# EAGLE design pulsometro (EAGLE 7.2.0)
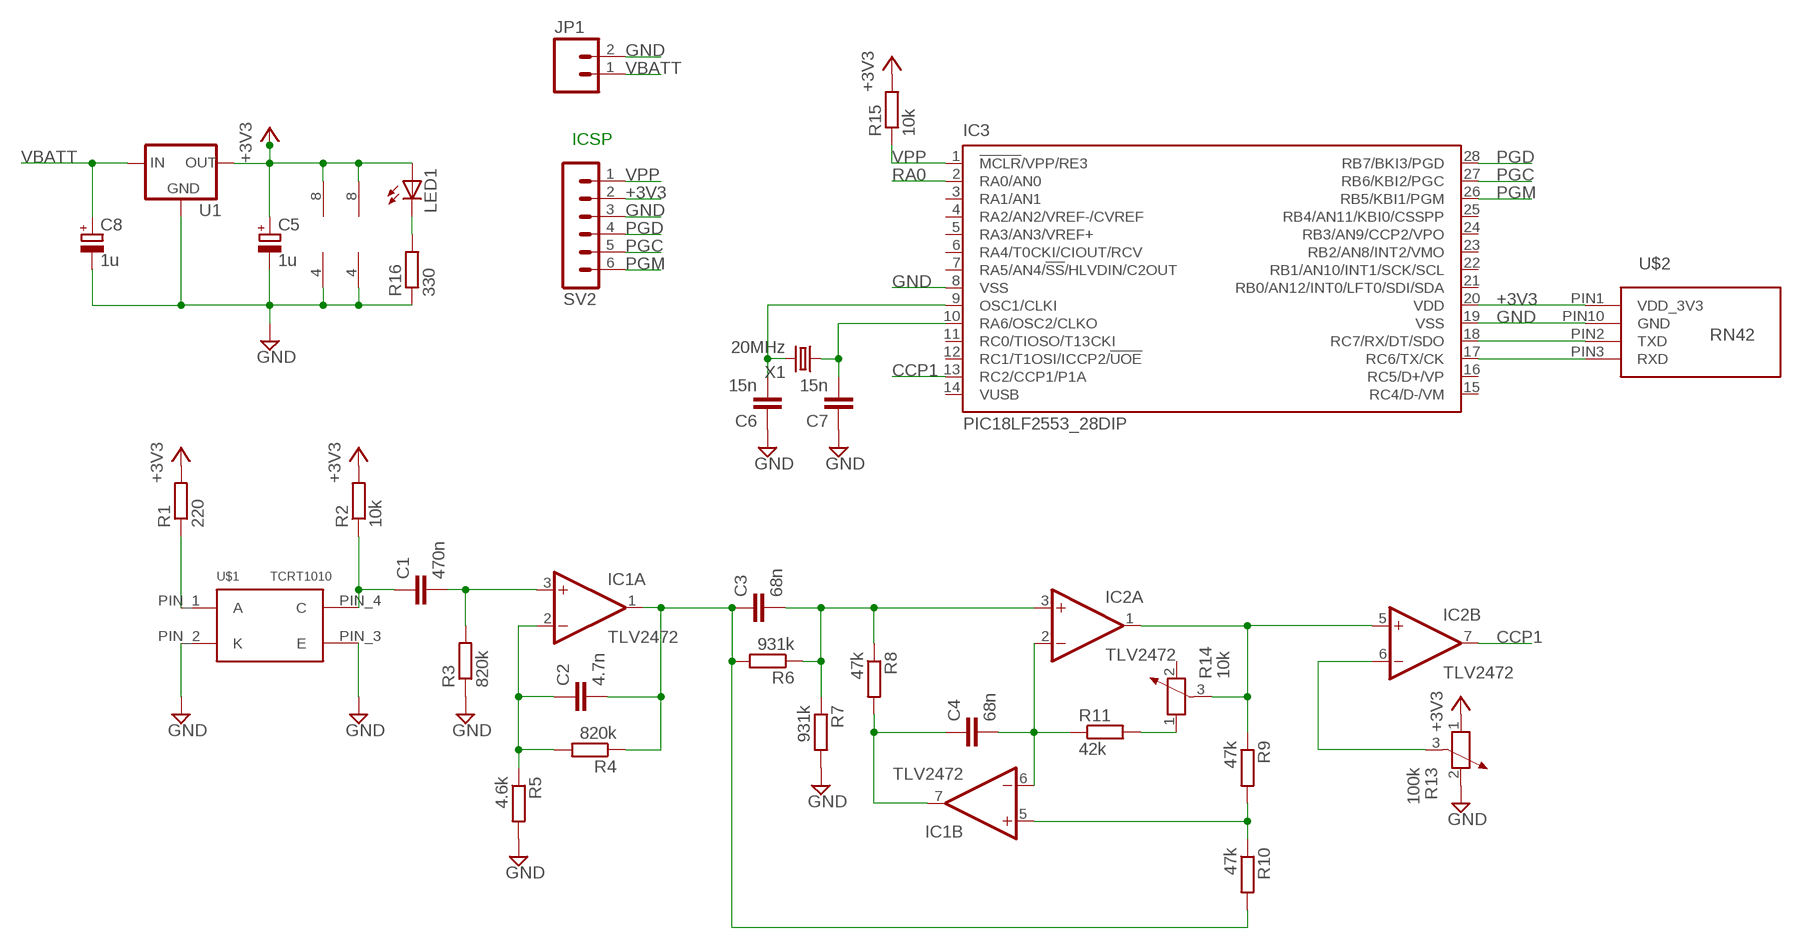
[diagram p0: schematic, sheet 1]

## Parts
C1  470n  C-EU025-025X050  [C025-025X050]
C2  4.7n  C-EU025-025X050  [C025-025X050]
C3  68n  C-EU025-025X050  [C025-025X050]
C4  68n  C-EU025-025X050  [C025-025X050]
C5  1u  CPOL-EUE2.5-5  [E2,5-5]
C6  15n  C-EU025-025X050  [C025-025X050]
C7  15n  C-EU025-025X050  [C025-025X050]
C8  1u  CPOL-EUE2.5-5  [E2,5-5]
IC1  TLV2472  LM358N  [DIL08]
IC2  TLV2472  LM358N  [DIL08]
IC3  PIC18LF2553_28DIP  PIC18F2550_28DIP  [DIL28-3]
JP1  M02PTH  [1X02]
LED1  LED3MM  [LED3MM]
R1  220  R-EU_0204/7  [0204/7]
R2  10k  R-EU_0204/7  [0204/7]
R3  820k  R-EU_0204/7  [0204/7]
R4  820k  R-EU_0204/7  [0204/7]
R5  4.6k  R-EU_0204/7  [0204/7]
R6  931k  R-EU_0204/7  [0204/7]
R7  931k  R-EU_0204/7  [0204/7]
R8  47k  R-EU_0204/7  [0204/7]
R9  47k  R-EU_0204/7  [0204/7]
R10  47k  R-EU_0204/7  [0204/7]
R11  42k  R-EU_0204/7  [0204/7]
R13  100k  POTENTIOMETER_PT-10  [PT-10]
R14  10k  POTENTIOMETER_PT-10  [PT-10]
R15  10k  R-EU_0204/7  [0204/7]
R16  330  R-EU_0204/7  [0204/7]
SV2  MA06-1  [MA06-1]
U1  V_REG_78XXTO-92_UNTESTED  [TO-92]
U$1  TCRT1010  [TCRT1010]
U$2  RN42  [2X10-2MMSOCKET]
X1  20MHz  CRYSTALS-NOGND-HC49  [HC49]

## Nets
+3V3: C5.+ IC1.8(P:V+) IC2.8(P:V+) IC3.20(VDD) LED1.A R1.2 R2.2 R13.1 R15.2 SV2.2 U1.3(OUT) U$2.PIN1(VDD_3V3)
CCP1: IC2.7(B:OUT) IC3.13(RC2/CCP1/P1A)
GND: C5.- C6.1 C7.1 C8.- IC1.4(P:V-) IC2.4(P:V-) IC3.8(VSS) IC3.19(VSS) JP1.2 R3.1 R5.2 R7.2 R13.2 R16.1 SV2.3 U1.1(GND) U$1.PIN_2(K) U$1.PIN_3(E) U$2.PIN10(GND)
N$1: R1.1 U$1.PIN_1(A)
N$3: C1.1 R2.1 U$1.PIN_4(C)
N$4: C2.1 IC1.2(A:-IN) R4.2 R5.1
N$5: C1.2 IC1.3(A:+IN) R3.2
N$6: C2.2 C3.1 IC1.1(A:OUT) R4.1 R6.2 R10.2
N$8: C3.2 IC2.3(A:+IN) R6.1 R7.1 R8.1
N$9: C4.1 IC1.7(B:OUT) R8.2
N$10: C4.2 IC1.6(B:-IN) IC2.2(A:-IN) R11.1
N$11: R11.2 R14.1
N$12: IC2.1(A:OUT) IC2.5(B:+IN) R9.1 R14.3
N$13: IC1.5(B:+IN) R9.2 R10.1
N$14: IC2.6(B:-IN) R13.3
N$15: IC3.18(RC7/RX/DT/SDO) U$2.PIN2(TXD)
N$16: IC3.17(RC6/TX/CK) U$2.PIN3(RXD)
N$17: LED1.K(C) R16.2
N$18: C7.2 IC3.10(RA6/OSC2/CLKO) X1.1
N$19: C6.2 IC3.9(OSC1/CLKI) X1.2
PGC: IC3.27(RB6/KBI2/PGC) SV2.5
PGD: IC3.28(RB7/BKI3/PGD) SV2.4
PGM: IC3.26(RB5/KBI1/PGM) SV2.6
RA0: IC3.2(RA0/AN0)
VBATT: C8.+ JP1.1 U1.2(IN)
VPP: IC3.1(!MCLR!/VPP/RE3) R15.1 SV2.1
Unconnected: IC3.3(RA1/AN1) IC3.4(RA2/AN2/VREF-/CVREF) IC3.5(RA3/AN3/VREF+) IC3.6(RA4/T0CKI/CIOUT/RCV) IC3.7(RA5/AN4/!SS!/HLVDIN/C2OUT) IC3.11(RC0/TIOSO/T13CKI) IC3.12(RC1/T1OSI/ICCP2/!UOE) IC3.14(VUSB) IC3.15(RC4/D-/VM) IC3.16(RC5/D+/VP) IC3.21(RB0/AN12/INT0/LFT0/SDI/SDA) IC3.22(RB1/AN10/INT1/SCK/SCL) IC3.23(RB2/AN8/INT2/VMO) IC3.24(RB3/AN9/CCP2/VPO) IC3.25(RB4/AN11/KBI0/CSSPP) R14.2

## Notes on the sheet
- ICSP

## Library data of the parts
C1-C4 C6 C7 = rcl:C-EU: CAPACITOR, European symbol
C5 C8 = rcl:CPOL-EU: POLARIZED CAPACITOR, European symbol
IC1 IC2 = linear:LM358: OP AMP also LM158; LM258; LM2904 Source: http://cache.national.com/ds/LM/LM158.pdf
IC3 = microchip:PIC18F2*_28: USB Microcontrollers with nanoWatt Technology High-Performance, Enhanced Flash, 28/40/44-Pin, Source: http://ww1.microchip.com/downloads/en/devicedoc/39632c.pdf; MF: MICROCHIP; MPN: PIC18F2550-I/SP; OC_FARNELL: 1523822; OC_NEWARK: 80K6054
JP1 = SparkFun-Connectors:M02: Standard 2-pin 0.1" header. Use with - straight break away headers ( PRT-00116) - right angle break away headers (PRT-00553) - swiss pins (PRT-00743) - machine pins (PRT-00117) - female headers (PRT-00115) Molex polarized connector foot print use with: PRT-08233 with associated crimp pins and housings. 2.54_SCREWTERM for use with PRT-10571. 3.5mm Screw Terminal footprints for PRT-08084 5mm Screw Terminal footprints for use with PRT-08432
LED1 = led:LED: LED OSRAM: - CHIPLED LG R971, LG N971, LY N971, LG Q971, LY Q971, LO R971, LY R971 LH N974, LH R974 LS Q976, LO Q976, LY Q976 LO Q996 - Hyper CHIPLED LW Q18S LB Q993, LB Q99A, LB R99A - SideLED LS A670, LO A670, LY A670, LG A670, LP A670 LB A673, LV A673, LT A673, LW A673 LH A674 LY A675 LS A676, LA A676, LO A676, LY A676, LW A676 LS A679, LY A679, LG A679 - Hyper Micro SIDELED® LS Y876, LA Y876, LO Y876, LY Y876 LT Y87S - SmartLED LW L88C, LW L88S LB L89C, LB L89S, LG L890 LS L89K, LO L89K, LY L89K LS L896, LA L896, LO L896, LY L896 - TOPLED LS T670, LO T670, LY T670, LG T670, LP T670 LSG T670, LSP T670, LSY T670, LOP T670, LYG T670 LG T671, LOG T671, LSG T671 LB T673, LV T673, LT T673, LW T673 LH T674 LS T676, LA T676, LO T676, LY T676, LB T676, LH T676, LSB T676, LW T676 LB T67C, LV T67C, LT T67C, LS T67K, LO T67K, LY T67K, LW E67C LS E67B, LA E67B, LO E67B, LY E67B, LB E67C, LV E67C, LT E67C LW T67C LS T679, LY T679, LG T679 LS T770, LO T770, LY T770, LG T770, LP T770 LB T773, LV T773, LT T773, LW T773 LH T774 LS E675, LA E675, LY E675, LS T675 LS T776, LA T776, LO T776, LY T776, LB T776 LHGB T686 LT T68C, LB T68C - Hyper Mini TOPLED® LB M676 - Mini TOPLED Santana® LG M470 LS M47K, LO M47K, LY M47K Source: http://www.osram.convergy.de LUXEON: - LUMILED® LXK2-PW12-R00, LXK2-PW12-S00, LXK2-PW14-U00, LXK2-PW14-V00 LXK2-PM12-R00, LXK2-PM12-S00, LXK2-PM14-U00 LXK2-PE12-Q00, LXK2-PE12-R00, LXK2-PE12-S00, LXK2-PE14-T00, LXK2-PE14-U00 LXK2-PB12-K00, LXK2-PB12-L00, LXK2-PB12-M00, LXK2-PB14-N00, LXK2-PB14-P00, LXK2-PB14-Q00 LXK2-PR12-L00, LXK2-PR12-M00, LXK2-PR14-Q00, LXK2-PR14-R00 LXK2-PD12-Q00, LXK2-PD12-R00, LXK2-PD12-S00 LXK2-PH12-R00, LXK2-PH12-S00 LXK2-PL12-P00, LXK2-PL12-Q00, LXK2-PL12-R00 Source: www.luxeon.com KINGBRIGHT: KA-3528ASYC Source: www.kingbright.com
R1-R11 R15 R16 = rcl:R-EU_: RESISTOR, European symbol
R13 R14 = rcl:POTENTIOMETER_: Potentiometer
SV2 = con-lstb:MA06-1: PIN HEADER; OC_FARNELL: unknown; OC_NEWARK: unknown
U1 = SparkFun-PowerIC:V_REG_78XX: Voltage Regulator Standard 78xx regulator. IGO (Input Ground Output). Spark Fun Electronics SKU : COM-00107
U$1 = pulsometro:TCRT1010
U$2 = pulsometro:RN42
X1 = IQD-Frequency-Products:CRYSTALS-NOGND: CRYSTALS CAN NOT GROUNDED

## Board
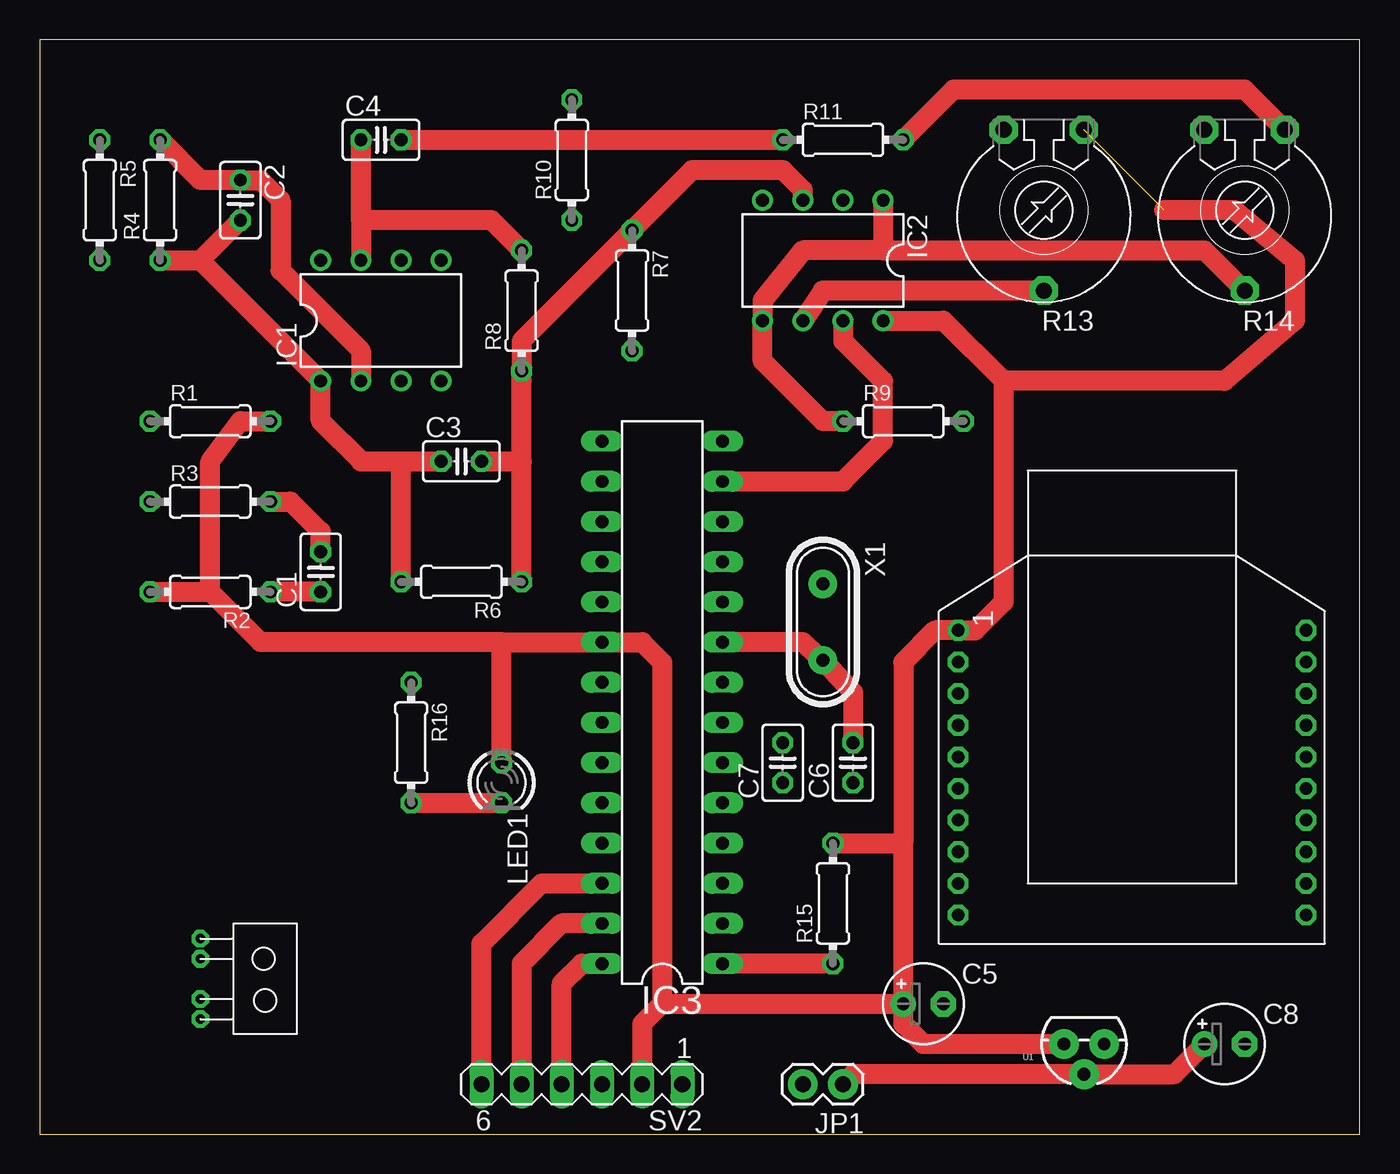
[diagram p1: board, top side]
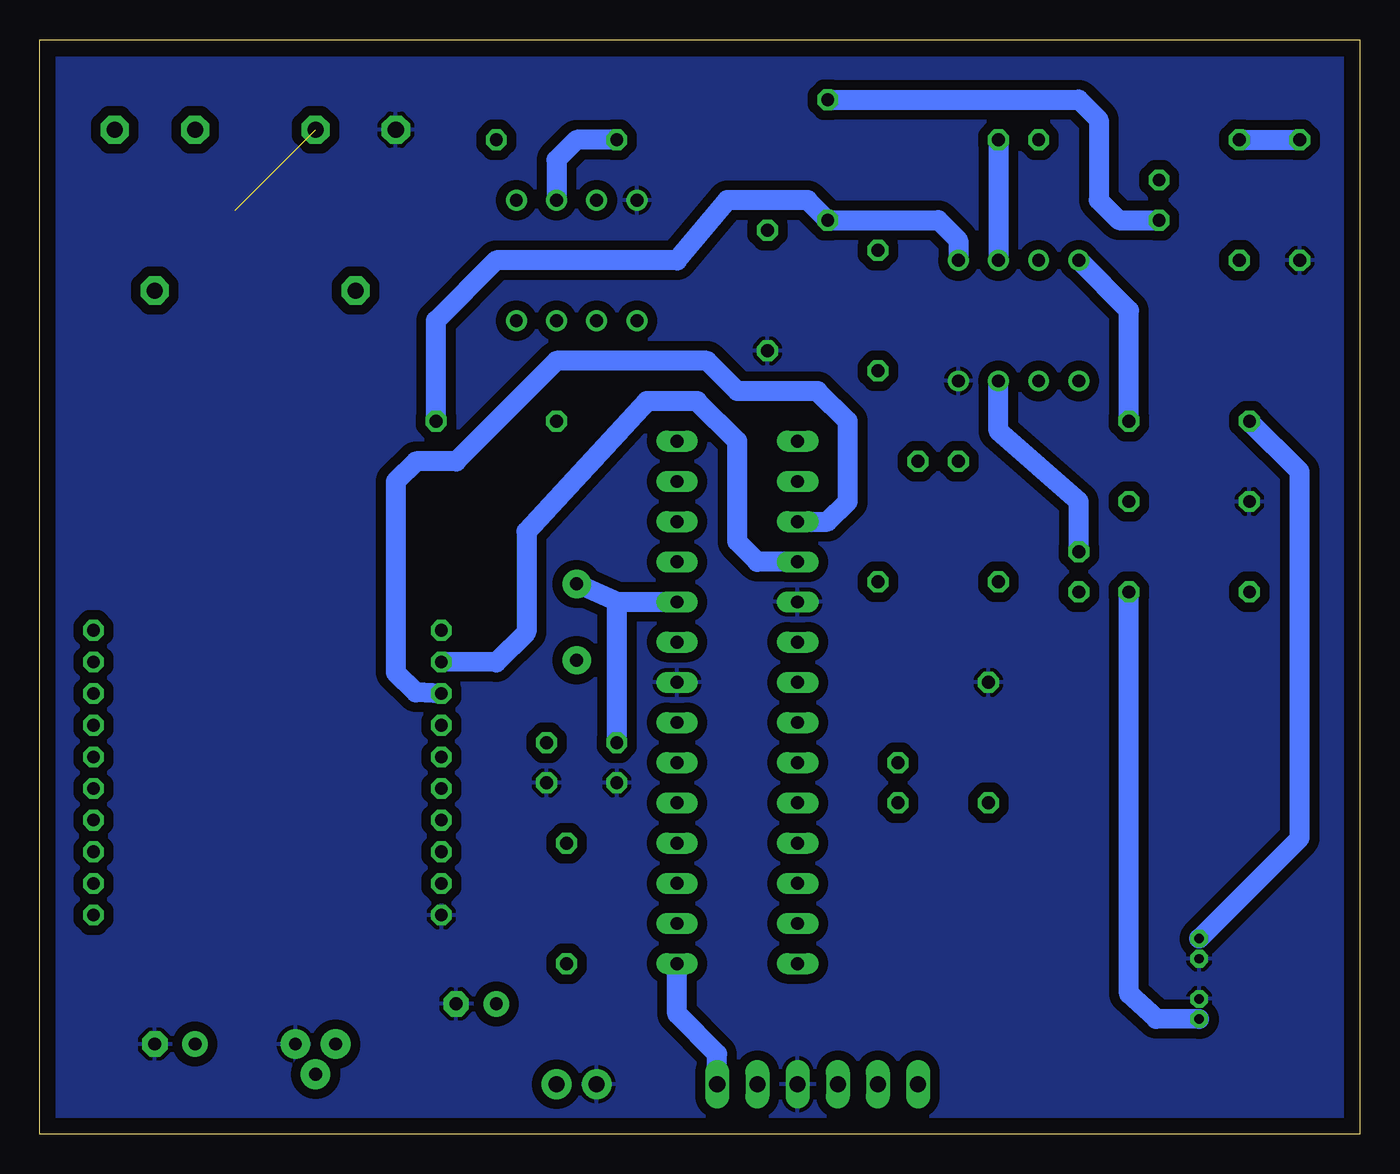
[diagram p2: board, bottom side, seen from below]

Size 83.49 x 69.21 mm. Coordinates in mm from the lower left corner, seen from the top.
Outline: 0,0 83.49,0 83.49,69.21 0,69.21 0,0
Copper layers (1*16): Top 0.035mm / dielectric 1.5mm / Bottom 0.035mm
Design rules "default *": minimum track width 50mil, minimum drill 24mil, track to track 24mil, track to pad 24mil, pad to pad 24mil, via to via 24mil, smd to smd 24mil, copper to edge 40mil, drill to drill 16mil, minimum pad ring 10mil, minimum via ring 8mil, stop-mask expansion 4mil, vias tented up to drill 0mil, thermal gap 10mil

### Footprints (pad centres in the part's own frame; a part is rotated, then mirrored left to right if it is on the bottom)
C025-025X050 = drill 0.813 octagon: 1 -1.27,0; 2 1.27,0
E2,5-5 = drill 0.813 pad 1.6: + -1.27,0 | drill 0.813 pad 1.6 octagon: - 1.27,0
DIL08 = drill 0.813 pad 1.27: 1 -3.81,-3.81; 2 -1.27,-3.81; 3 1.27,-3.81; 4 3.81,-3.81; 5 3.81,3.81; 6 1.27,3.81; 7 -1.27,3.81; 8 -3.81,3.81
DIL28-3 = drill 0.813 long: 1 -16.51,-3.81; 2 -13.97,-3.81; 3 -11.43,-3.81; 4 -8.89,-3.81; 5 -6.35,-3.81; 6 -3.81,-3.81; 7 -1.27,-3.81; 8 1.27,-3.81; 9 3.81,-3.81; 10 6.35,-3.81; 11 8.89,-3.81; 12 11.43,-3.81; 13 13.97,-3.81; 14 16.51,-3.81; 15 16.51,3.81; 16 13.97,3.81; 17 11.43,3.81; 18 8.89,3.81; 19 6.35,3.81; 20 3.81,3.81; 21 1.27,3.81; 22 -1.27,3.81; 23 -3.81,3.81; 24 -6.35,3.81; 25 -8.89,3.81; 26 -11.43,3.81; 27 -13.97,3.81; 28 -16.51,3.81
1X02 = drill 1.016 pad 1.88: 1 0,0; 2 2.54,0
LED3MM = drill 0.813 octagon: A -1.27,0; K 1.27,0
0204/7 = drill 0.813 octagon: 1 -3.81,0; 2 3.81,0
PT-10 = drill 1.016 pad 1.778 octagon: 1 -2.54,-5.08; 2 2.54,-5.08; 3 0,5.08
MA06-1 = drill 1.016 long: 1 -6.35,0; 2 -3.81,0; 3 -1.27,0; 4 1.27,0; 5 3.81,0; 6 6.35,0
TO-92 = drill 0.813 pad 1.88: 1 -1.27,0; 2 0,1.905; 3 1.27,0
TCRT1010 = drill 0.6 pad 0.813 octagon: PIN_1 0.96,0; PIN_2 2.23,0; PIN_3 4.77,0; PIN_4 6.04,0
2X10-2MMSOCKET = drill 0.8 octagon: P$1 1.8,1.2; P$2 3.8,1.2; P$3 5.8,1.2; P$4 7.8,1.2; P$5 9.8,1.2; P$6 11.8,1.2; P$7 13.8,1.2; P$8 15.8,1.2; P$9 17.8,1.2; P$10 19.8,1.2; P$12 3.8,23.2; P$13 5.8,23.2; P$14 7.8,23.2; P$15 9.8,23.2; P$16 11.8,23.2; P$17 13.8,23.2; PIN1 19.8,23.2; PIN2 17.8,23.2; PIN3 15.8,23.2; PIN10 1.8,23.2
HC49 = drill 0.813 pad 1.8: 1 -2.413,0; 2 2.413,0

### Placement (x,y rotation side)
C1  17.78,35.56 90 top
C2  12.7,59.05 270 top
C3  26.67,42.55 0 top
C4  21.59,62.87 0 top
C5  55.88,8.25 0 top
C6  51.43,23.49 90 top
C7  46.99,23.49 90 top
C8  74.93,5.71 0 top
IC1  21.59,51.43 0 top
IC2  49.53,55.24 180 top
IC3  39.37,27.3 90 top
JP1  50.8,3.18 180 top
LED1  29.21,22.23 270 top
R1  10.79,45.09 0 top
R2  10.79,34.29 180 top
R3  10.79,40.01 0 top
R4  7.62,59.05 90 top
R5  3.81,59.05 270 top
R6  26.67,34.92 180 top
R7  37.46,53.34 270 top
R8  30.48,52.07 90 top
R9  54.61,45.09 0 top
R10  33.66,61.6 90 top
R11  50.8,62.87 0 top
R13  63.5,58.42 180 top
R14  76.2,58.42 180 top
R15  50.16,14.61 90 top
R16  23.49,24.77 270 top
SV2  34.29,3.18 180 top
U1  66.04,5.71 180 top
U$1  10.16,13.34 270 top
U$2  81.28,12.06 90 top
X1  49.53,32.38 270 top

### Tracks (layer width: path | path; a pad name or v marks a point on that pad's centre or on a via)
+3V3  (1 unrouted)
  Top 1.27: R15.2 54.61,18.41 | 54.61,18.41 54.61,29.84 56.63,31.87 U$2.PIN1 59.17,31.87 60.96,33.66 60.96,47.62 | LED1.A 29.21,31.12 | 29.21,31.12 IC3.20 38.1,31.12 39.37,29.84 39.37,8.25 | IC2.8 57.15,51.43 60.96,47.62 | 60.96,47.62 74.93,47.62 79.38,51.43 79.38,55.24 75.57,58.42 71.12,58.42 | 39.37,8.25 38.1,6.98 SV2.2 | C5.+ 54.61,18.41 | 29.21,31.12 13.97,31.12 10.79,34.29 | 10.79,34.29 10.79,42.55 12.7,45.09 R1.2 | R2.2 10.79,34.29 | 39.37,8.25 C5.+ | U1.3 55.88,5.71 54.61,6.98 C5.+
  Bottom 1.27: IC1.8 14.6,52.07 R1.2
CCP1
  Top 1.27: IC3.13 50.8,41.27 53.34,43.81 53.34,47.62 50.8,50.16 IC2.7
GND
  pour Bottom: 0,68.58 83.82,68.58 83.82,0 0,0
N$1
  Bottom 1.27: U$1.PIN_1 3.81,18.73 3.81,41.91 R1.1
N$3
  Top 1.27: C1.1 R2.1
  Bottom 1.27: U$1.PIN_4 12.89,7.3 14.6,8.89 R2.1
N$4
  Top 1.27: R4.2 10.16,60.32 C2.1 13.97,60.32 15.24,59.05 15.24,54.61 20.32,49.53 IC1.2
  Bottom 1.27: R4.2 R5.1
N$5
  Top 1.27: C1.2 17.78,38.1 15.87,40.01 R3.2
  Bottom 1.27: IC1.3 22.86,44.45 17.78,40.01 C1.2
N$6
  Top 1.27: 22.86,42.55 20.32,42.55 17.78,45.09 IC1.1 10.16,55.24 | 22.86,42.55 C3.1 | R6.2 22.86,42.55 | R4.1 10.16,55.24 | C2.2 10.16,55.24
  Bottom 1.27: R10.2 17.78,65.41 16.51,64.13 16.51,59.05 15.24,57.79 C2.2
N$8
  Top 1.27: R6.1 30.48,42.55 | 30.48,42.55 30.48,47.62 R8.1 30.48,50.16 R7.1 41.27,60.96 46.99,60.96 48.26,59.69 IC2.3 | C3.2 30.48,42.55
N$9
  Top 1.27: 20.32,57.79 IC1.7 | 20.32,57.79 28.57,57.79 R8.2 | 20.32,57.79 C4.1
N$10
  Top 1.27: C4.2 R11.1
  Bottom 1.27: C4.2 IC1.6 | R11.1 49.53,62.87 50.8,61.6 IC2.2
N$11
  Top 1.27: R11.2 57.79,66.04 76.2,66.04 R14.1
N$12
  Top 1.27: 53.34,55.88 48.26,55.88 45.72,52.71 IC2.5 45.72,48.89 49.53,45.09 R9.1 | IC2.1 53.34,55.88 | 53.34,55.88 73.66,55.88 R14.3
N$13
  Bottom 1.27: R9.2 58.42,51.43 54.61,55.24 43.18,55.24 40,59.05 34.92,59.05 R10.1 26.67,57.79 25.4,56.51 IC1.5
N$14
  Top 1.27: IC2.6 49.53,53.34 R13.3
N$15
  Bottom 1.27: U$2.PIN2 54.61,29.84 52.7,31.75 52.7,38.1 45.09,46.35 41.91,46.35 39.37,43.81 39.37,37.46 38.1,36.2 IC3.18
N$16
  Bottom 1.27: U$2.PIN3 59.69,27.94 60.96,29.21 60.96,41.27 59.69,42.55 57.15,42.55 50.8,48.89 41.27,48.89 39.37,46.99 34.29,46.99 32.38,45.09 32.38,40.01 33.66,38.73 IC3.17
N$17
  Top 1.27: R16.2 LED1.K
N$18
  Bottom 1.27: C7.2 46.99,33.66 | 46.99,33.66 X1.1 | 46.99,33.66 IC3.10
N$19
  Top 1.27: IC3.9 48.26,31.12 X1.2 51.43,27.94 C6.2
N$20
  pour Top: 53.34,18.41 54.61,19.69 54.61,17.14
N$22
  pour Top: 27.94,31.12 29.21,29.84 30.48,31.12
N$23
  pour Top: 21.59,42.55 22.86,41.27 24.13,42.55
N$24
  pour Top: 29.84,42.55 30.48,41.91 30.48,43.18
N$25
  pour Top: 11.43,56.51 10.16,55.24 11.43,53.98
N$26
  pour Top: 21.59,57.79 20.32,59.05 20.32,56.51
N$27
  pour Top: 60.96,47.62 62.23,47.62 60.96,46.35
N$28
  pour Top: 10.79,34.29 9.53,34.29 10.79,35.56
N$29
  pour Top: 39.37,9.52 40.64,8.25 39.37,8.25
N$30
  pour Top: 54.61,9.52 53.34,8.25 54.61,6.98
PGC
  Top 1.27: IC3.27 33.02,13.34 30.48,10.79 SV2.5
PGD
  Top 1.27: SV2.4 33.02,9.52 34.29,10.79 IC3.28
PGM
  Top 1.27: SV2.6 27.94,12.06 31.75,15.88 IC3.26
VBATT
  Top 1.27: JP1.1 51.43,3.81 U1.2 71.76,3.81 C8.+
VPP
  Top 1.27: R15.1 IC3.1
  Bottom 1.27: SV2.1 40.64,5.08 43.18,7.62 IC3.1